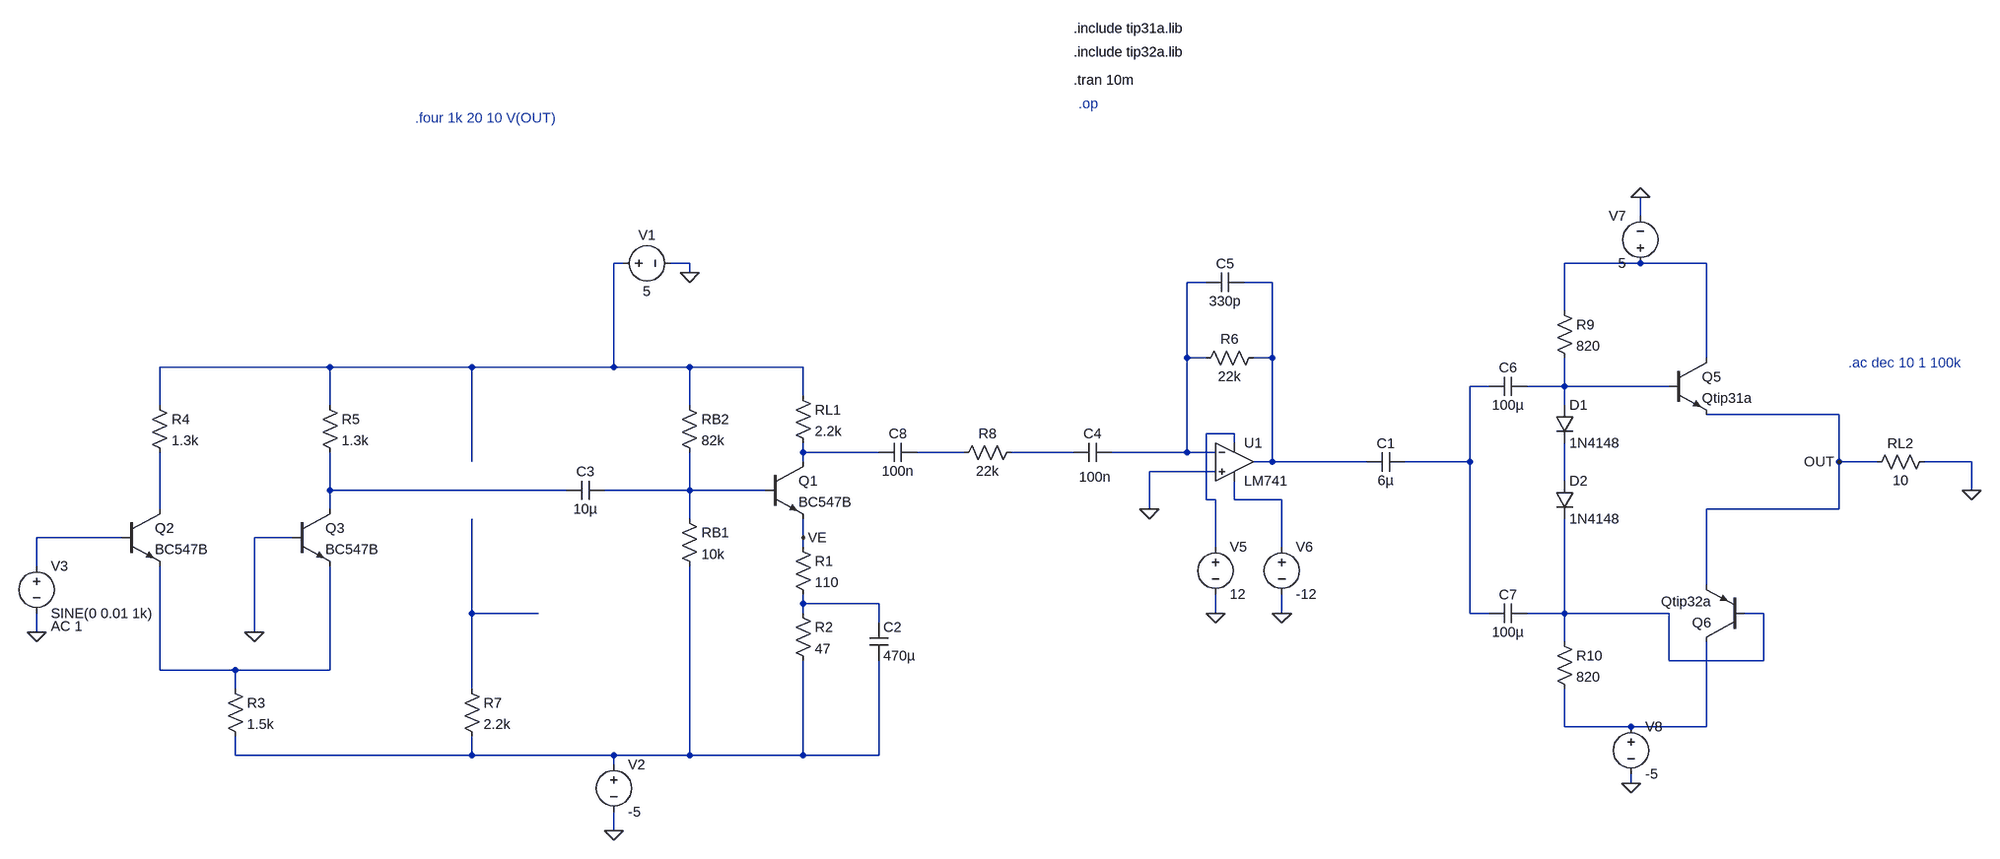
[diagram p0: schematic final.asc]
final.asc, the LTspice schematic file:
Version 4
SHEET 1 2404 680
WIRE 1824 -400 1824 -432
WIRE 96 -320 80 -320
WIRE 208 -320 176 -320
WIRE 1824 -320 1696 -320
WIRE 1936 -320 1824 -320
WIRE 208 -304 208 -320
WIRE 1088 -288 1056 -288
WIRE 1200 -288 1152 -288
WIRE 1696 -240 1696 -320
WIRE 1056 -160 1056 -288
WIRE 1088 -160 1056 -160
WIRE 1200 -160 1200 -288
WIRE 1200 -160 1168 -160
WIRE 1936 -160 1936 -320
WIRE -400 -144 -688 -144
WIRE -160 -144 -400 -144
WIRE 80 -144 80 -320
WIRE 80 -144 -160 -144
WIRE 208 -144 80 -144
WIRE 400 -144 208 -144
WIRE 1568 -112 1536 -112
WIRE 1696 -112 1696 -160
WIRE 1696 -112 1632 -112
WIRE 1872 -112 1696 -112
WIRE 400 -96 400 -144
WIRE -688 -80 -688 -144
WIRE -400 -80 -400 -144
WIRE 208 -80 208 -144
WIRE 1696 -80 1696 -112
WIRE 2160 -64 1936 -64
WIRE 1136 -32 1088 -32
WIRE 1136 -16 1136 -32
WIRE 400 0 400 -16
WIRE 528 0 400 0
WIRE 672 0 592 0
WIRE 864 0 752 0
WIRE 1056 0 1056 -160
WIRE 1056 0 928 0
WIRE 1104 0 1056 0
WIRE -160 16 -160 -144
WIRE 400 16 400 0
WIRE 1200 16 1200 -160
WIRE 1200 16 1168 16
WIRE 1360 16 1200 16
WIRE 1536 16 1536 -112
WIRE 1536 16 1424 16
WIRE 2160 16 2160 -64
WIRE 2224 16 2160 16
WIRE 2384 16 2304 16
WIRE 1104 32 992 32
WIRE 1696 48 1696 -16
WIRE -400 64 -400 0
WIRE 0 64 -400 64
WIRE 208 64 208 0
WIRE 208 64 64 64
WIRE 336 64 208 64
WIRE 2384 64 2384 16
WIRE 1088 80 1088 -32
WIRE 1104 80 1088 80
WIRE 1136 80 1136 48
WIRE 1216 80 1136 80
WIRE -688 96 -688 0
WIRE -400 96 -400 64
WIRE 992 96 992 32
WIRE 2160 96 2160 16
WIRE 2160 96 1936 96
WIRE 208 112 208 64
WIRE -752 144 -896 144
WIRE -464 144 -528 144
WIRE 400 144 400 112
WIRE 400 160 400 144
WIRE 1104 160 1104 80
WIRE 1216 160 1216 80
WIRE -896 192 -896 144
WIRE 1936 224 1936 96
WIRE 400 256 400 240
WIRE 528 256 400 256
WIRE -160 272 -160 112
WIRE -48 272 -160 272
WIRE 400 272 400 256
WIRE 1104 272 1104 240
WIRE 1216 272 1216 240
WIRE 1536 272 1536 16
WIRE 1568 272 1536 272
WIRE 1696 272 1696 112
WIRE 1696 272 1632 272
WIRE 1872 272 1696 272
WIRE 2032 272 2000 272
WIRE 528 288 528 256
WIRE -896 304 -896 272
WIRE -528 304 -528 144
WIRE 1696 320 1696 272
WIRE 1872 352 1872 272
WIRE 2032 352 2032 272
WIRE 2032 352 1872 352
WIRE -688 368 -688 192
WIRE -560 368 -688 368
WIRE -400 368 -400 192
WIRE -400 368 -560 368
WIRE -560 400 -560 368
WIRE -160 400 -160 272
WIRE 1696 464 1696 400
WIRE 1808 464 1696 464
WIRE 1936 464 1936 320
WIRE 1936 464 1808 464
WIRE -560 512 -560 480
WIRE -160 512 -160 480
WIRE -160 512 -560 512
WIRE 80 512 -160 512
WIRE 208 512 208 192
WIRE 208 512 80 512
WIRE 400 512 400 352
WIRE 400 512 208 512
WIRE 528 512 528 352
WIRE 528 512 400 512
WIRE 80 528 80 512
WIRE 1808 560 1808 544
WIRE 80 640 80 608
FLAG 208 -304 0
FLAG 80 640 0
FLAG -896 304 0
FLAG 400 144 VE
FLAG -528 304 0
FLAG 992 96 0
FLAG 1104 272 0
FLAG 1216 272 0
FLAG 1808 560 0
FLAG 1824 -432 0
FLAG 2384 64 0
FLAG 2160 16 OUT
SYMBOL res 192 96 R0
SYMATTR InstName RB1
SYMATTR Value 10k
SYMBOL res 192 -96 R0
SYMATTR InstName RB2
SYMATTR Value 82k
SYMBOL npn 336 16 R0
SYMATTR InstName Q1
SYMATTR Value BC547B
SYMBOL res 384 -112 R0
SYMATTR InstName RL1
SYMATTR Value 2.2k
SYMBOL voltage 80 -320 R270
WINDOW 0 32 56 VTop 2
WINDOW 3 -32 56 VBottom 2
WINDOW 123 0 0 Left 0
WINDOW 39 0 0 Left 0
SYMATTR InstName V1
SYMATTR Value 5
SYMBOL Res 384 144 R0
SYMATTR InstName R1
SYMATTR Value 110
SYMBOL Res 384 256 R0
SYMATTR InstName R2
SYMATTR Value 47
SYMBOL Cap 512 288 R0
SYMATTR InstName C2
SYMATTR Value 470µ
SYMBOL Voltage 80 512 R0
SYMATTR InstName V2
SYMATTR Value -5
SYMBOL npn -752 96 R0
SYMATTR InstName Q2
SYMATTR Value BC547B
SYMBOL npn -464 96 R0
SYMATTR InstName Q3
SYMATTR Value BC547B
SYMBOL Res -576 384 R0
SYMATTR InstName R3
SYMATTR Value 1.5k
SYMBOL Voltage -896 176 R0
WINDOW 123 24 118 Left 2
WINDOW 39 0 0 Left 0
SYMATTR Value2 AC 1
SYMATTR InstName V3
SYMATTR Value SINE(0 0.01 1k)
SYMBOL Res -704 -96 R0
SYMATTR InstName R4
SYMATTR Value 1.3k
SYMBOL Res -416 -96 R0
SYMATTR InstName R5
SYMATTR Value 1.3k
SYMBOL Cap 64 48 R90
WINDOW 0 0 32 VBottom 2
WINDOW 3 32 32 VTop 2
SYMATTR InstName C3
SYMATTR Value 10µ
SYMBOL Cap 928 -16 R90
WINDOW 0 0 32 VBottom 2
WINDOW 3 42 28 VTop 2
SYMATTR InstName C4
SYMATTR Value 100n
SYMBOL LM741 1136 -48 R0
SYMATTR InstName U1
SYMBOL Res 1184 -176 R90
WINDOW 0 0 56 VBottom 2
WINDOW 3 32 56 VTop 2
SYMATTR InstName R6
SYMATTR Value 22k
SYMBOL Cap 1152 -304 R90
WINDOW 0 0 32 VBottom 2
WINDOW 3 32 32 VTop 2
SYMATTR InstName C5
SYMATTR Value 330p
SYMBOL Voltage 1104 144 R0
SYMATTR InstName V5
SYMATTR Value 12
SYMBOL Voltage 1216 144 R0
SYMATTR InstName V6
SYMATTR Value -12
SYMBOL Res -176 384 R0
SYMATTR InstName R7
SYMATTR Value 2.2k
SYMBOL Res 768 -16 R90
WINDOW 0 0 56 VBottom 2
WINDOW 3 32 56 VTop 2
SYMATTR InstName R8
SYMATTR Value 22k
SYMBOL Cap 1632 -128 R90
WINDOW 0 0 32 VBottom 2
WINDOW 3 32 32 VTop 2
SYMATTR InstName C6
SYMATTR Value 100µ
SYMBOL Cap 1632 256 R90
WINDOW 0 0 32 VBottom 2
WINDOW 3 32 32 VTop 2
SYMATTR InstName C7
SYMATTR Value 100µ
SYMBOL Res 1680 -256 R0
SYMATTR InstName R9
SYMATTR Value 820
SYMBOL Res 1680 304 R0
SYMATTR InstName R10
SYMATTR Value 820
SYMBOL npn 1872 -160 R0
SYMATTR InstName Q5
SYMATTR Value Qtip31a
SYMBOL pnp 2000 320 R180
SYMATTR InstName Q6
SYMATTR Value Qtip32a
SYMBOL Voltage 1824 -304 R180
WINDOW 0 24 96 Left 2
WINDOW 3 24 16 Left 2
SYMATTR InstName V7
SYMATTR Value 5
SYMBOL Voltage 1808 448 R0
SYMATTR InstName V8
SYMATTR Value -5
SYMBOL Res 2320 0 R90
WINDOW 0 0 56 VBottom 2
WINDOW 3 32 56 VTop 2
SYMATTR InstName RL2
SYMATTR Value 10
SYMBOL diode 1680 -80 R0
SYMATTR InstName D1
SYMATTR Value 1N4148
SYMBOL diode 1680 48 R0
SYMATTR InstName D2
SYMATTR Value 1N4148
SYMBOL Cap 1424 0 R90
WINDOW 0 0 32 VBottom 2
WINDOW 3 32 32 VTop 2
SYMATTR InstName C1
SYMATTR Value 6µ
SYMBOL Cap 592 -16 R90
WINDOW 0 0 32 VBottom 2
WINDOW 3 32 32 VTop 2
SYMATTR InstName C8
SYMATTR Value 100n
TEXT 864 -768 Left 2 !.include tip31a.lib
TEXT 864 -728 Left 2 !.include tip32a.lib
TEXT 864 -680 Left 2 !.tran 10m
TEXT 2176 -152 Left 2 ;.ac dec 10 1 100k
TEXT -256 -616 Left 2 ;.four 1k 20 10 V(OUT)
TEXT 872 -640 Left 2 ;.op

The netlist it stands for:
* final.asc
RB1 N013 N022 10k
RB2 N001 N013 82k
Q1 N008 N013 VE 0 BC547B
RL1 N001 N008 2.2k
V1 N001 0 5
R1 VE N017 110
R2 N017 N022 47
C2 N017 N022 470µ
V2 N022 0 -5
Q2 N015 N016 N020 0 BC547B
Q3 N012 0 N020 0 BC547B
R3 N020 N022 1.5k
V3 N016 0 SINE(0 0.01 1k) AC 1
R4 N001 N015 1.3k
R5 N001 N012 1.3k
C3 N013 N012 10µ
C4 N003 N010 100n
XU1 0 N003 N007 N014 N004 LM741  ; pins In+ In- V+ V- OUT
R6 N004 N003 22k
C5 N004 N003 330p
V5 N007 0 12
V6 N014 0 -12
R7 N018 N022 2.2k
R8 N010 N009 22k
C6 N006 N005 100µ
C7 N019 N005 100µ
R9 N002 N006 820
R10 N019 N021 820
Q5 N002 N006 OUT 0 Qtip31a
Q6 N021 N019 OUT 0 Qtip32a
V7 N002 0 5
V8 N021 0 -5
RL2 0 OUT 10
D1 N006 N011 1N4148
D2 N011 N019 1N4148
C1 N005 N004 6µ
C8 N009 N008 100n
.model D D
.lib standard.dio
.model NPN NPN
.model PNP PNP
.lib standard.bjt
.include tip31a.lib
.include tip32a.lib
.tran 10m
* .ac dec 10 1 100k
* .four 1k 20 10 V(OUT)
* .op
.lib LM741.lib
.backanno
.end